# Altium schematic sheet ESC.SchDoc: ESC
size A; Revision: REV1; SheetNumber: 3; SheetTotal: 5
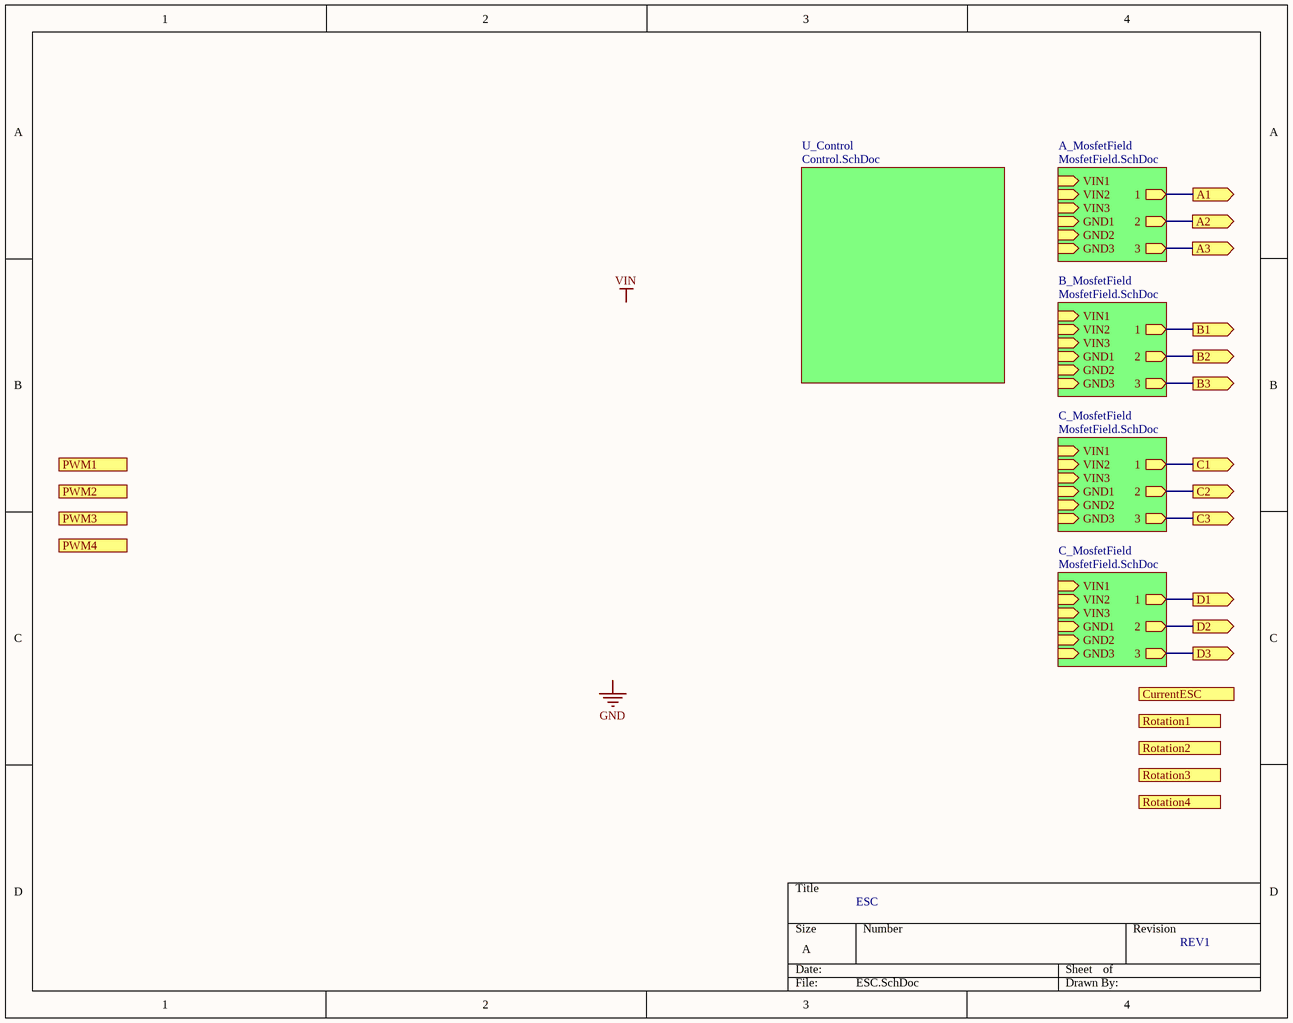
[diagram p0: ESC.SchDoc]

## Sub-sheets
A_MosfetField = MosfetField.SchDoc: VIN1 (in), GND1 (in), GND2 (in), GND3 (in), 1 (out), 3 (out), 2 (out), VIN3 (in), VIN2 (in)
B_MosfetField = MosfetField.SchDoc: VIN1 (in), GND1 (in), GND2 (in), GND3 (in), 1 (out), 3 (out), 2 (out), VIN3 (in), VIN2 (in)
C_MosfetField = MosfetField.SchDoc: VIN1 (in), GND1 (in), GND2 (in), GND3 (in), 1 (out), 3 (out), 2 (out), VIN3 (in), VIN2 (in)
C_MosfetField = MosfetField.SchDoc: VIN1 (in), GND1 (in), GND2 (in), GND3 (in), 1 (out), 3 (out), 2 (out), VIN3 (in), VIN2 (in)
U_Control = Control.SchDoc: no entries

## Ports
A1 (out), A2 (out), A3 (out), B1 (out), B2 (out), B3 (out), C1 (out), C2 (out), C3 (out), CurrentESC (out), D1 (out), D2 (out), D3 (out), PWM1 (in), PWM2 (in), PWM3 (in), PWM4 (in), Rotation1 (out), Rotation2 (out), Rotation3 (out), Rotation4 (out)

## Nets
A1: port A1, sheet A_MosfetField/1
A2: port A2, sheet A_MosfetField/2
A3: port A3, sheet A_MosfetField/3
B1: port B1, sheet B_MosfetField/1
B2: port B2, sheet B_MosfetField/2
B3: port B3, sheet B_MosfetField/3
C1: port C1, sheet C_MosfetField/1
C2: port C2, sheet C_MosfetField/2
C3: port C3, sheet C_MosfetField/3
D1: port D1, sheet C_MosfetField/1
D2: port D2, sheet C_MosfetField/2
D3: port D3, sheet C_MosfetField/3

## Notes on the sheet
- Labels drawn without touching a wire or pin: GND, VIN